# Altium schematic sheet JS7628_base_ethernet_v1.0.SchDoc
size A4
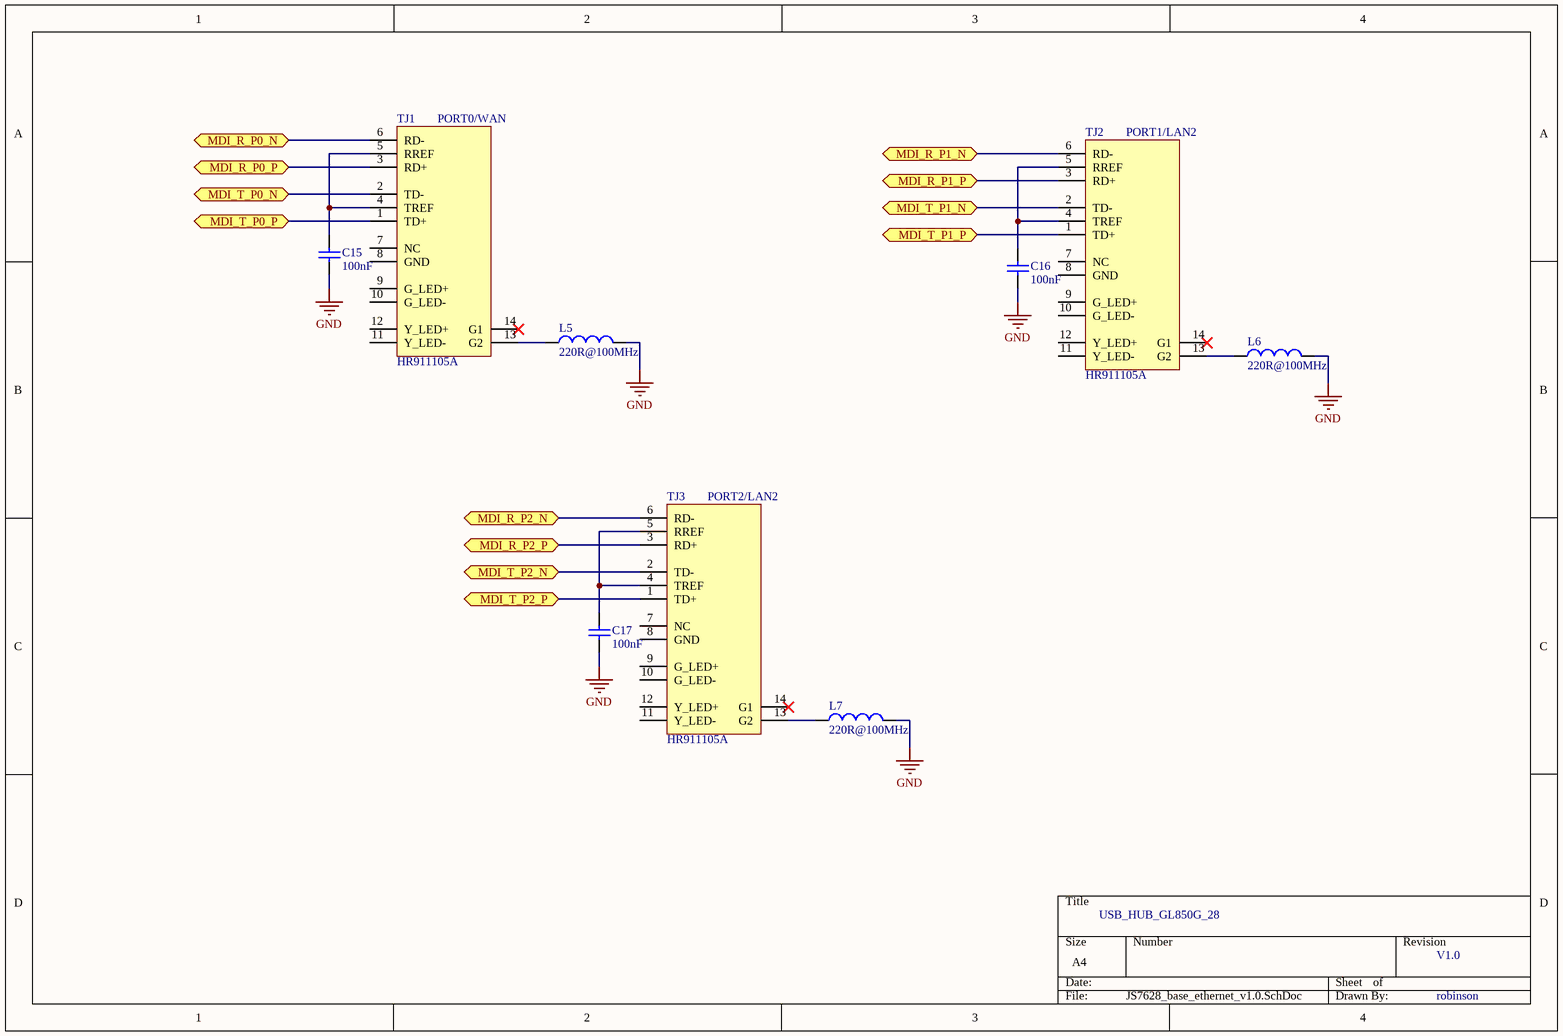
[diagram p0: JS7628_base_ethernet_v1.0.SchDoc]

## Parts
C15  value 100nF  [0603]  (hidden comment: CAP-SMT)
C16  value 100nF  [0603]  (hidden comment: CAP-SMT)
C17  value 100nF  [0603]  (hidden comment: CAP-SMT)
L5  value 220R@100MHz  [0603]  (hidden comment: inductor)
L6  value 220R@100MHz  [0603]  (hidden comment: inductor)
L7  value 220R@100MHz  [0603]  (hidden comment: inductor)
TJ1  HR911105A  string: PORT0/WAN  [HR911105A]
TJ2  HR911105A  string: PORT1/LAN2  [HR911105A]
TJ3  HR911105A  string: PORT2/LAN2  [HR911105A]

## Ports
MDI_R_P0_N, MDI_R_P0_P, MDI_R_P1_N, MDI_R_P1_P, MDI_R_P2_N, MDI_R_P2_P, MDI_T_P0_N, MDI_T_P0_P, MDI_T_P1_N, MDI_T_P1_P, MDI_T_P2_N, MDI_T_P2_P

## Nets
GND: C15.1 C16.1 C17.1 L5.2 L6.2 L7.2
MDI_R_P0_N: TJ1.6(RD-) ; port MDI_R_P0_N
MDI_R_P0_P: TJ1.3(RD+) ; port MDI_R_P0_P
MDI_R_P1_N: TJ2.6(RD-) ; port MDI_R_P1_N
MDI_R_P1_P: TJ2.3(RD+) ; port MDI_R_P1_P
MDI_R_P2_N: TJ3.6(RD-) ; port MDI_R_P2_N
MDI_R_P2_P: TJ3.3(RD+) ; port MDI_R_P2_P
MDI_T_P0_N: TJ1.2(TD-) ; port MDI_T_P0_N
MDI_T_P0_P: TJ1.1(TD+) ; port MDI_T_P0_P
MDI_T_P1_N: TJ2.2(TD-) ; port MDI_T_P1_N
MDI_T_P1_P: TJ2.1(TD+) ; port MDI_T_P1_P
MDI_T_P2_N: TJ3.2(TD-) ; port MDI_T_P2_N
MDI_T_P2_P: TJ3.1(TD+) ; port MDI_T_P2_P
NetC15_2: C15.2 TJ1.4(TREF) TJ1.5(RREF)
NetC16_2: C16.2 TJ2.4(TREF) TJ2.5(RREF)
NetC17_2: C17.2 TJ3.4(TREF) TJ3.5(RREF)
NetL5_1: L5.1 TJ1.13(G2)
NetL6_1: L6.1 TJ2.13(G2)
NetL7_1: L7.1 TJ3.13(G2)

Not connected (* = marked no-connect by the designer): TJ1 7(NC) 8(GND) 9(G_LED+) 10(G_LED-) 11(Y_LED-) 12(Y_LED+) 14(G1)*; TJ2 7(NC) 8(GND) 9(G_LED+) 10(G_LED-) 11(Y_LED-) 12(Y_LED+) 14(G1)*; TJ3 7(NC) 8(GND) 9(G_LED+) 10(G_LED-) 11(Y_LED-) 12(Y_LED+) 14(G1)*

## Notes on the sheet
- USB_HUB_GL850G_28
- V1.0
- robinson